# Altium schematic sheet Sheet2.SchDoc
size A3
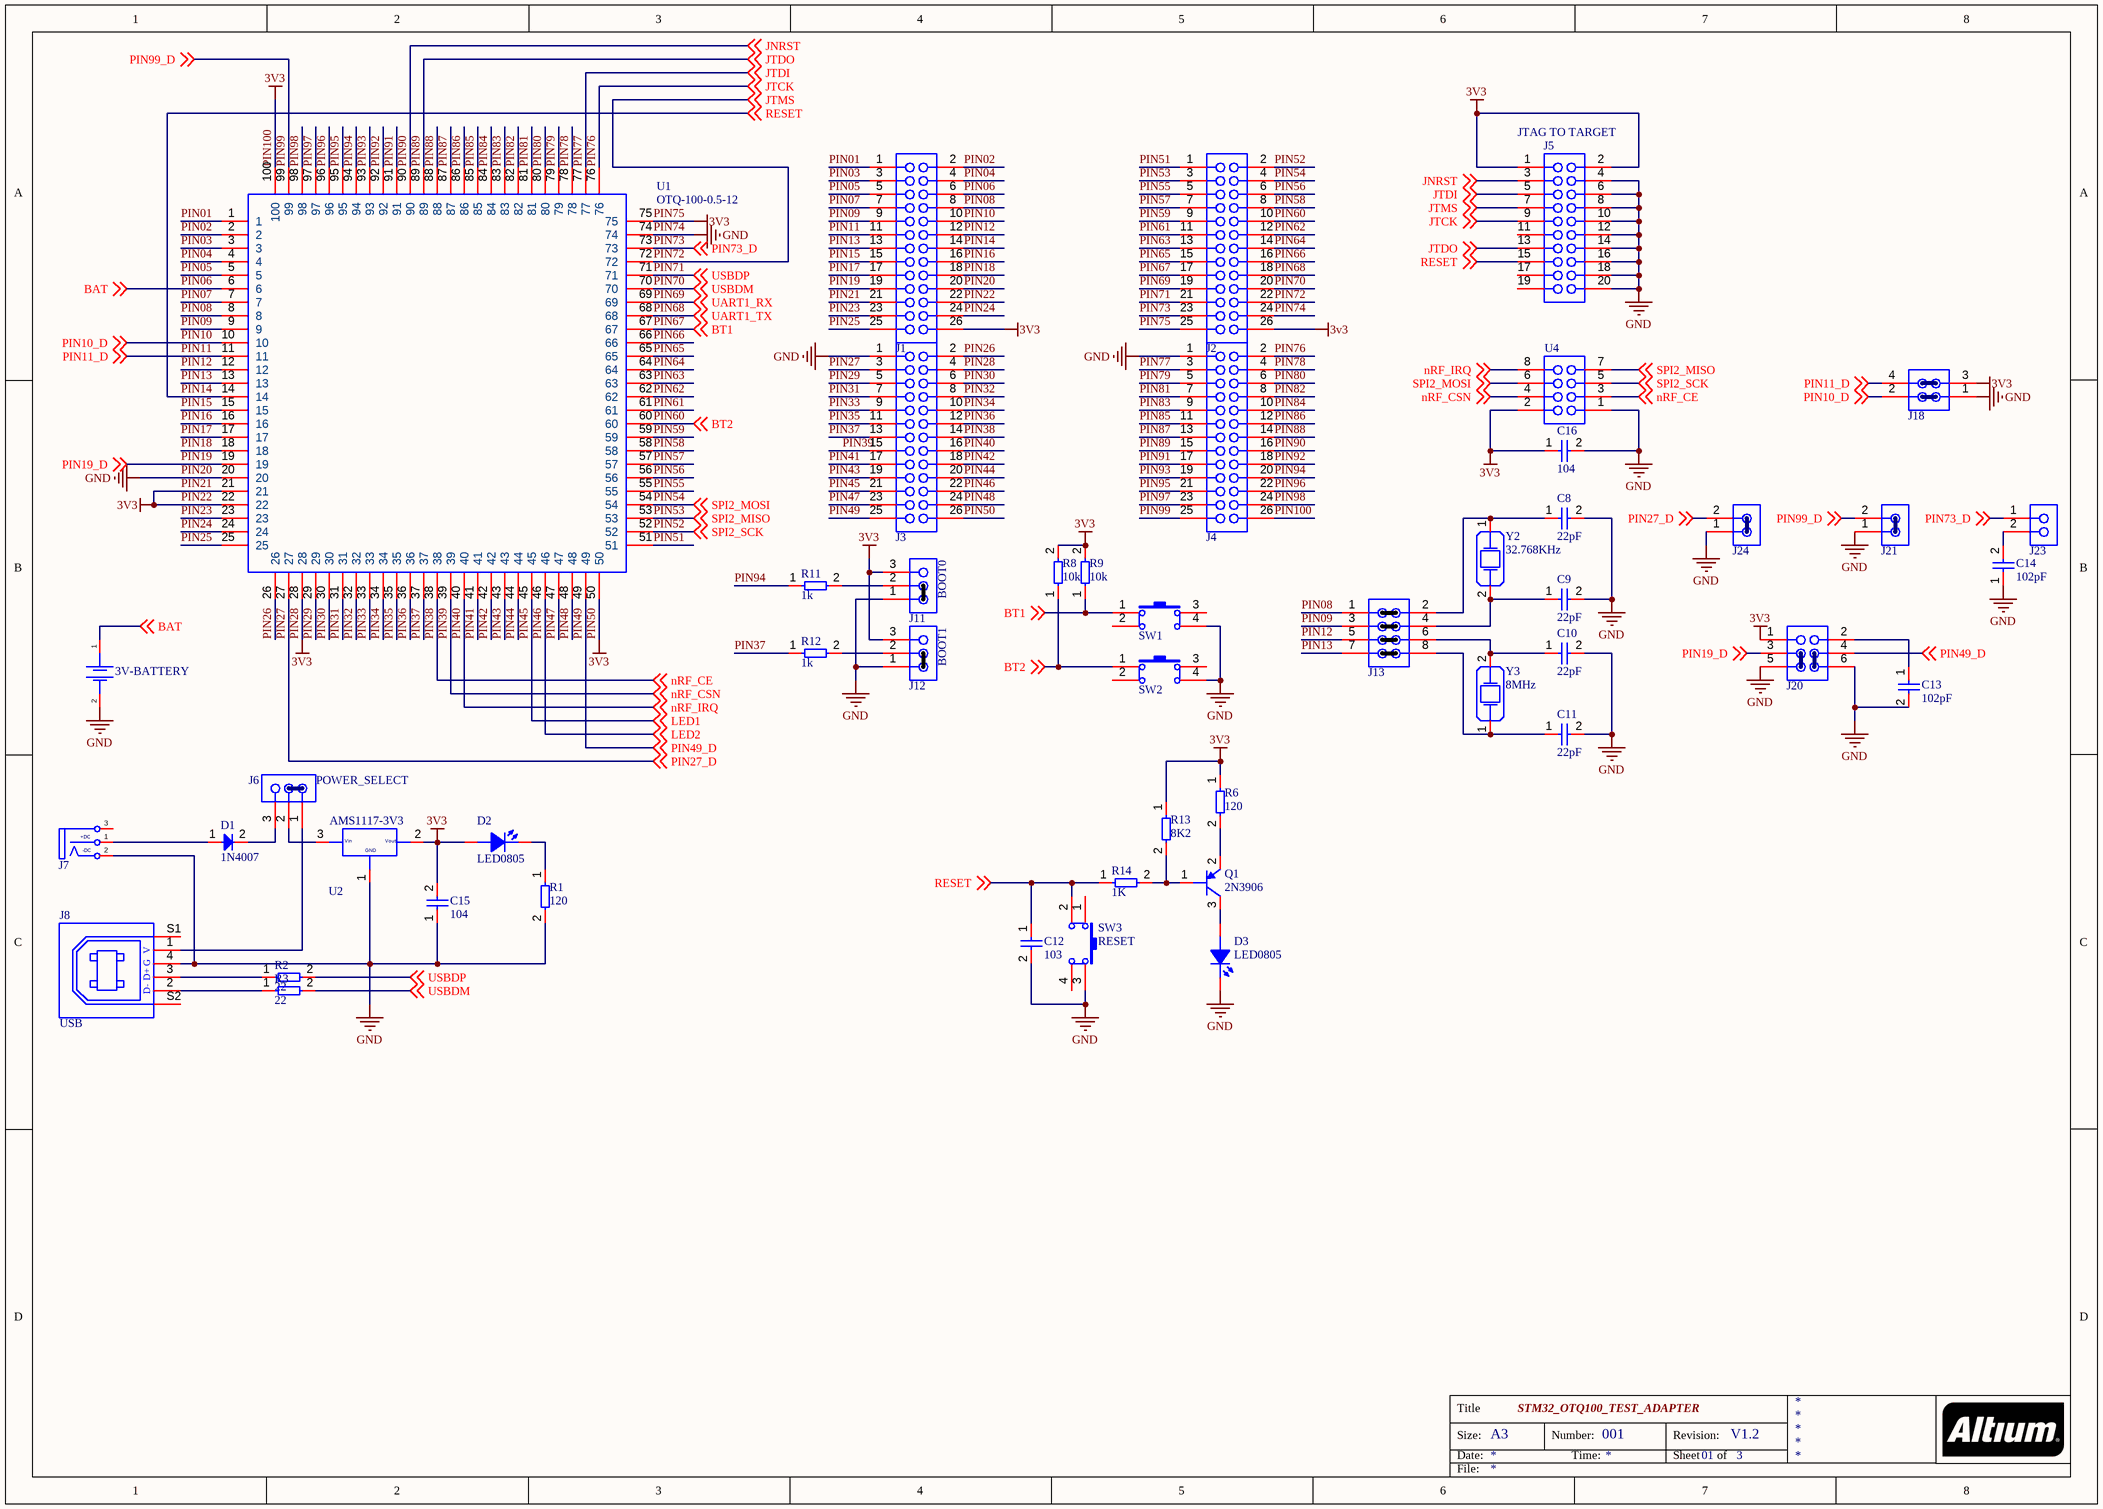
[diagram p0: Sheet2.SchDoc]

## Parts
B1  3V-BATTERY  [CR1220]
C8  22pF  [C0805]
C9  22pF  [C0805]
C10  22pF  [C0805]
C11  22pF  [C0805]
C12  103  [C0805]
C13  102pF  [C0805]
C14  102pF  [C0805]
C15  104  [C1206]
C16  104  [C1206]
D1  1N4007  [DO-214AC(SMA)]
D2  LED0805  [L0805RED]
D3  LED0805  [L0805RED]
J1  Header 13x2 TH Pitch 2.54mm  [Header 13x2 TH Pitch 2.54mm]  (value not drawn)
J2  Header 13x2 TH Pitch 2.54mm  [Header 13x2 TH Pitch 2.54mm]  (value not drawn)
J3  Header 13x2 TH Pitch 2.54mm  [Header 13x2 TH Pitch 2.54mm]  (value not drawn)
J4  Header 13x2 TH Pitch 2.54mm  [Header 13x2 TH Pitch 2.54mm]  (value not drawn)
J5  JTAG TO TARGET  [IDC_CONNECTOR_20_2.54]
J6  POWER_SELECT  [Header 3x1 TH Pitch 2.54mm]
J7  5V-DC  [DC_JACK_161-0721]  (value not drawn)
J8  USB  [USB-B-TYPE]
J11  BOOT0  [PIN_HEADER_1X3_PITCH_2MM_HEIGTH_5MM]
J12  BOOT1  [PIN_HEADER_1X3_PITCH_2MM_HEIGTH_5MM]
J13  PIN_HEADER_4X2_PITCH_2MM_HEIGTH_5MM  [PIN_HEADER_4X2_PITCH_2MM_HEIGTH_5MM]  (value not drawn)
J18  PIN_HEADER_2X2_PITCH_2MM_HEIGTH_5MM  [PIN_HEADER_2X2_PITCH_2MM_HEIGTH_5MM]  (value not drawn)
J20  PIN_HEADER_3X2_PITCH_2MM_HEIGTH_5MM  [PIN_HEADER_3X2_PITCH_2MM_HEIGTH_5MM]  (value not drawn)
J21  PIN_HEADER_1X2_PITCH_2MM_HEIGTH_5MM  [PIN_HEADER_1X2_PITCH_2MM_HEIGTH_5MM]  (value not drawn)
J23  PIN_HEADER_1X2_PITCH_2MM_HEIGTH_5MM  [PIN_HEADER_1X2_PITCH_2MM_HEIGTH_5MM]  (value not drawn)
J24  PIN_HEADER_1X2_PITCH_2MM_HEIGTH_5MM  [PIN_HEADER_1X2_PITCH_2MM_HEIGTH_5MM]  (value not drawn)
Q1  2N3906  [SOT23-3]
R1  120  [R0805]
R2  22  [R0805]
R3  22  [R0805]
R6  120  [R0805]
R8  10k  [R0805]
R9  10k  [R0805]
R11  1k  [R0805]
R12  1k  [R0805]
R13  8K2  [R0805]
R14  1K  [R0805]
SW1  Button Hole  [BUTTON_HOLE_5.0mm]  (value not drawn)
SW2  Button Hole  [BUTTON_HOLE_5.0mm]  (value not drawn)
SW3  RESET  [BUTTON_HOLE_5.0mm]
U1  OTQ-100-0.5-12  [ENPLAS OTQ-100-0.5-12]
U2  AMS1117-3V3  [SOT223-3]
U4  nRF24L01  [Header 4x2 TH Pitch 2.54mm]  (value not drawn)
Y2  32.768KHz  [DT-26]
Y3  8MHz  [SMD5032]

## Nets
PIN20: B1.2 C8.2 C9.2 C10.2 C11.2 C12.2 C13.2 C14.1 C15.1 C16.2 D3.2(K) J1.20 J2.24 J3.1 J4.1 J5.4 J5.6 J5.8 J5.10 J5.12 J5.14 J5.16 J5.18 J5.20 J7.2(DC-) J8.4 J11.1 J12.1 J18.1 J20.5 J20.6 J21.1 J24.1 R1.2 SW1.4 SW2.4 SW3.3 U1.20 U1.74 U2.1 U4.1  [also labelled GND, PIN74]
PIN100: C15.2 C16.1 D2.1(A) J1.21 J1.22 J1.26 J2.25 J2.26 J3.4 J3.26 J4.26 J5.1 J5.2 J11.3 J12.3 J18.3 J20.1 R6.1 R8.2 R9.2 R13.1 U1.21 U1.22 U1.28 U1.50 U1.75 U1.100 U2.2 U4.2  [also labelled 3V3, PIN21, PIN22, PIN28, PIN50, PIN75]
PIN01: J1.1 U1.1
PIN02: J1.2 U1.2
PIN03: J1.3 U1.3
PIN04: J1.4 U1.4
PIN05: J1.5 U1.5
PIN06: B1.1 J1.6 U1.6 ; off-sheet BAT  [also labelled BAT]
PIN07: J1.7 U1.7
PIN08: J1.8 J13.1 U1.8
PIN09: J1.9 J13.3 U1.9
PIN10: J1.10 J18.2 U1.10 ; off-sheet PIN10_D  [also labelled PIN10_D]
PIN11: J1.11 J18.4 U1.11 ; off-sheet PIN11_D  [also labelled PIN11_D]
PIN12: J1.12 J13.5 U1.12
PIN13: J1.13 J13.7 U1.13
PIN14: C12.1 J1.14 J5.15 R14.1 SW3.2 U1.14 ; off-sheet RESET  [also labelled RESET]
PIN15: J1.15 U1.15
PIN16: J1.16 U1.16
PIN17: J1.17 U1.17
PIN18: J1.18 U1.18
PIN19: J1.19 J20.3 U1.19 ; off-sheet PIN19_D  [also labelled PIN19_D]
PIN23: J1.23 U1.23
PIN24: J1.24 U1.24
PIN25: J1.25 U1.25
PIN26: J3.2 U1.26
PIN27: J3.3 J24.2 U1.27 ; off-sheet PIN27_D  [also labelled PIN27_D]
PIN29: J3.5 U1.29
PIN30: J3.6 U1.30
PIN31: J3.7 U1.31
PIN32: J3.8 U1.32
PIN33: J3.9 U1.33
PIN34: J3.10 U1.34
PIN35: J3.11 U1.35
PIN36: J3.12 U1.36
PIN37: J3.13 R12.1 U1.37
PIN38: J3.14 U1.38 U4.3 ; off-sheet nRF_CE  [also labelled nRF_CE]
PIN39: J3.15 U1.39 U4.4 ; off-sheet nRF_CSN  [also labelled nRF_CSN]
PIN40: J3.16 U1.40 U4.8 ; off-sheet nRF_IRQ  [also labelled nRF_IRQ]
PIN41: J3.17 U1.41
PIN42: J3.18 U1.42
PIN43: J3.19 U1.43
PIN44: J3.20 U1.44
PIN45: J3.21 U1.45 ; off-sheet LED1  [also labelled LED1]
PIN46: J3.22 U1.46 ; off-sheet LED2  [also labelled LED2]
PIN47: J3.23 U1.47
PIN48: J3.24 U1.48
PIN49: J3.25 J20.4 U1.49 ; off-sheet PIN49_D  [also labelled PIN49_D]
PIN51: J2.1 U1.51
PIN52: J2.2 U1.52 U4.5 ; off-sheet SPI2_SCK  [also labelled SPI2_SCK]
PIN53: J2.3 U1.53 U4.7 ; off-sheet SPI2_MISO  [also labelled SPI2_MISO]
PIN54: J2.4 U1.54 U4.6 ; off-sheet SPI2_MOSI  [also labelled SPI2_MOSI]
PIN55: J2.5 U1.55
PIN56: J2.6 U1.56
PIN57: J2.7 U1.57
PIN58: J2.8 U1.58
PIN59: J2.9 U1.59
PIN60: J2.10 R8.1 SW2.1 U1.60 ; off-sheet BT2  [also labelled BT2]
PIN61: J2.11 U1.61
PIN62: J2.12 U1.62
PIN63: J2.13 U1.63
PIN64: J2.14 U1.64
PIN65: J2.15 U1.65
PIN66: J2.16 U1.66
PIN67: J2.17 R9.1 SW1.1 U1.67 ; off-sheet BT1  [also labelled BT1]
PIN68: J2.18 U1.68 ; off-sheet UART1_TX  [also labelled UART1_TX]
PIN69: J2.19 U1.69 ; off-sheet UART1_RX  [also labelled UART1_RX]
PIN70: J2.20 R3.2 U1.70 ; off-sheet USBDM  [also labelled USBDM]
PIN71: J2.21 R2.2 U1.71 ; off-sheet USBDP  [also labelled USBDP]
PIN72: J2.22 J5.7 U1.72 ; off-sheet JTMS  [also labelled JTMS]
PIN73: J2.23 J23.1 U1.73 ; off-sheet PIN73_D  [also labelled PIN73_D]
PIN76: J4.2 J5.9 U1.76 ; off-sheet JTCK  [also labelled JTCK]
PIN77: J4.3 J5.5 U1.77 ; off-sheet JTDI  [also labelled JTDI]
PIN78: J4.4 U1.78
PIN79: J4.5 U1.79
PIN80: J4.6 U1.80
PIN81: J4.7 U1.81
PIN82: J4.8 U1.82
PIN83: J4.9 U1.83
PIN84: J4.10 U1.84
PIN85: J4.11 U1.85
PIN86: J4.12 U1.86
PIN87: J4.13 U1.87
PIN88: J4.14 U1.88
PIN89: J4.15 J5.13 U1.89 ; off-sheet JTDO  [also labelled JTDO]
PIN90: J4.16 J5.3 U1.90 ; off-sheet JNRST  [also labelled JNRST]
PIN91: J4.17 U1.91
PIN92: J4.18 U1.92
PIN93: J4.19 U1.93
PIN94: J4.20 R11.1 U1.94
PIN95: J4.21 U1.95
PIN96: J4.22 U1.96
PIN97: J4.23 U1.97
PIN98: J4.24 U1.98
PIN99: J4.25 J21.2 U1.99 ; off-sheet PIN99_D  [also labelled PIN99_D]
NetC8_1: C8.1 J13.2 Y2.1
NetC9_1: C9.1 J13.4 Y2.2
NetC10_1: C10.1 J13.6 Y3.2
NetC11_1: C11.1 J13.8 Y3.1
NetC13_1: C13.1 J20.2
NetC14_2: C14.2 J23.2
NetD1_1: D1.1 J7.1(DS+)
NetD1_2: D1.2 J6.3
NetD2_2: D2.2(K) R1.1
NetD3_1: D3.1(A) Q1.3(C)
NetJ6_1: J6.1 J8.1
NetJ6_2: J6.2 U2.3
NetJ8_2: J8.2 R3.1
NetJ8_3: J8.3 R2.1
NetJ11_2: J11.2 R11.2
NetJ12_2: J12.2 R12.2
NetQ1_1: Q1.1(B) R13.2 R14.2
NetQ1_2: Q1.2(E) R6.2

Not connected (* = marked no-connect by the designer): J5 11 17 19; J7 3(T); J8 S1 S2; SW1 2 3; SW2 2 3; SW3 1 4

## Notes on the sheet
- Title
- Size:
- Date:
- A3
- STM32_OTQ100_TEST_ADAPTER
- Number:
- Time:
- 001
- Revision:
- Sheet
- 01
- of
- V1.2
- 3
- File:
- (in symbol AMS1117(SOT-223)) Vin; Vout; GND
- (in symbol JackDC) +DC; -DC
- (in symbol USB B Type) V; G; D+; D-

## Library data of the parts
B1 = Batery
C8-C12 = C0805
C13 C14 = Capacitors(SMD)
C15 C16 = C1206
D1 = Diode 1N4007-DO214AC(SMA)
J5 = IDC_2.54_10x2
J6 = Header 3x1 TH Pitch 2.54mm
J7 = JackDC
J8 = USB B Type
J11 J12 = PIN_HEADER_1X3_PITCH_2MM_HEIGTH_5MM
R1-R3 = R0805
R6 R8 R9 R11-R14 = Resistor SMD
SW3 = Button Hole
U1 = ENPLAS OTQ-100-0.5-12
U2 = AMS1117(SOT-223)
U4 = Header 4x2 TH Pitch 2.54mm
Y2 = Crystal 32.768KHz
Y3 = Crystal